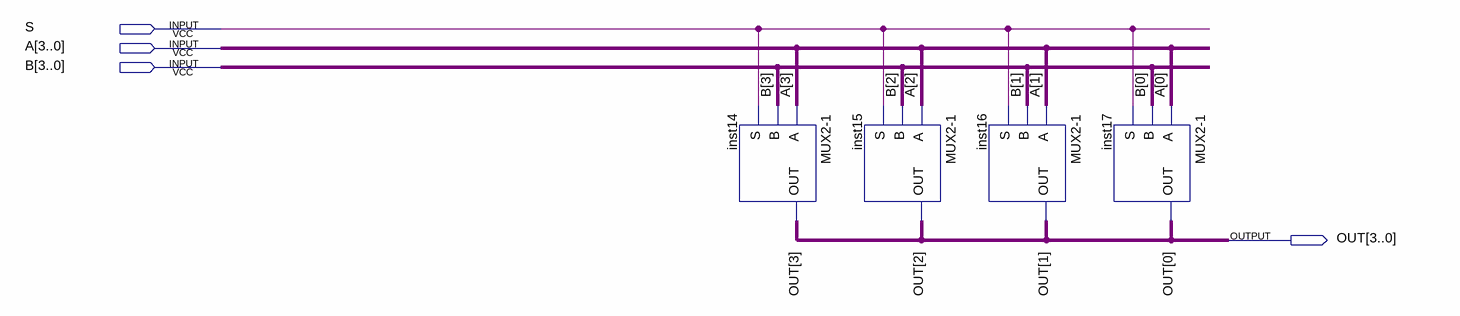
[diagram p0: schematic sheet]
// Quartus schematic MUX2-1_4BIT.bdf as structural Verilog: 4 symbols, 4 pins
module \MUX2-1_4BIT  (
  input  S,
  input  [3:0] A,
  input  [3:0] B,
  output [3:0] OUT
);

  \MUX2-1  inst14 (.A(A[3]), .B(B[3]), .S(S), .OUT(OUT[3]));
  \MUX2-1  inst15 (.A(A[2]), .B(B[2]), .S(S), .OUT(OUT[2]));
  \MUX2-1  inst16 (.A(A[1]), .B(B[1]), .S(S), .OUT(OUT[1]));
  \MUX2-1  inst17 (.A(A[0]), .B(B[0]), .S(S), .OUT(OUT[0]));
endmodule
